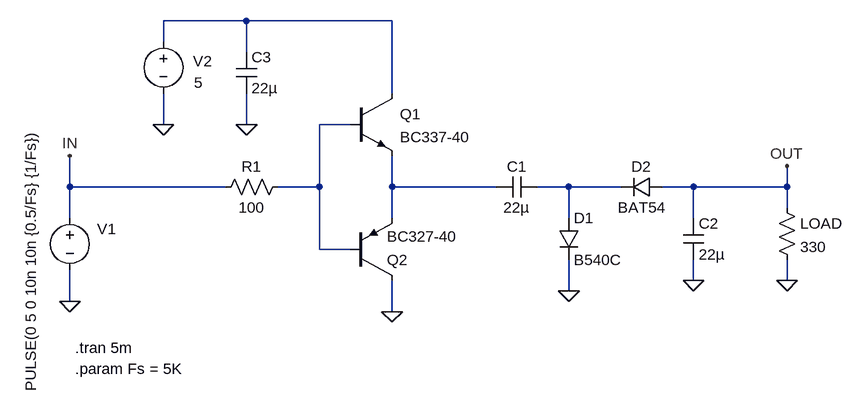
[diagram p0: schematic v1.0.asc]
v1.0.asc, the LTspice schematic file:
Version 4.1
SHEET 1 880 772
WIRE -288 -96 -416 -96
WIRE -64 -96 -288 -96
WIRE -416 -64 -416 -96
WIRE -288 -48 -288 -96
WIRE -64 16 -64 -96
WIRE -416 64 -416 16
WIRE -288 64 -288 16
WIRE -128 64 -176 64
WIRE -560 160 -560 112
WIRE -320 160 -560 160
WIRE -176 160 -176 64
WIRE -176 160 -240 160
WIRE -64 160 -64 112
WIRE 96 160 -64 160
WIRE 208 160 160 160
WIRE 288 160 208 160
WIRE 400 160 352 160
WIRE 544 160 544 128
WIRE 544 160 400 160
WIRE 544 192 544 160
WIRE -560 208 -560 160
WIRE -64 208 -64 160
WIRE 208 208 208 160
WIRE 400 208 400 160
WIRE -176 256 -176 160
WIRE -128 256 -176 256
WIRE 400 304 400 272
WIRE 544 304 544 272
WIRE 208 320 208 272
WIRE -560 336 -560 288
WIRE -64 352 -64 304
FLAG 400 304 0
FLAG 208 320 0
FLAG -560 336 0
FLAG -560 112 IN
FLAG 544 128 OUT
FLAG -64 352 0
FLAG -416 64 0
FLAG -288 64 0
FLAG 544 304 0
SYMBOL cap 160 144 R90
WINDOW 0 0 32 VBottom 2
WINDOW 3 32 32 VTop 2
SYMATTR InstName C1
SYMATTR Value 22µ
SYMBOL diode 192 208 R0
SYMATTR InstName D1
SYMATTR Value B540C
SYMBOL diode 352 144 R90
WINDOW 0 0 32 VBottom 2
WINDOW 3 32 32 VTop 2
SYMATTR InstName D2
SYMATTR Value BAT54
SYMBOL cap 384 208 R0
SYMATTR InstName C2
SYMATTR Value 22µ
SYMBOL voltage -560 192 R0
WINDOW 3 -60 -121 VRight 2
WINDOW 123 0 0 Left 0
WINDOW 39 0 0 Left 0
WINDOW 0 42 33 Left 2
SYMATTR Value PULSE(0 5 0 10n 10n {0.5/Fs} {1/Fs})
SYMATTR InstName V1
SYMBOL npn -128 16 R0
WINDOW 0 76 32 Left 2
WINDOW 3 76 67 Left 2
SYMATTR InstName Q1
SYMATTR Value BC337-40
SYMBOL pnp -128 304 M180
SYMATTR InstName Q2
SYMATTR Value BC327-40
SYMBOL voltage -416 -80 R0
WINDOW 0 46 46 Left 2
WINDOW 3 47 79 Left 2
WINDOW 123 0 0 Left 0
WINDOW 39 0 0 Left 0
SYMATTR InstName V2
SYMATTR Value 5
SYMBOL res -224 144 R90
WINDOW 0 0 56 VBottom 2
WINDOW 3 32 56 VTop 2
SYMATTR InstName R1
SYMATTR Value 100
SYMBOL cap -304 -48 R0
SYMATTR InstName C3
SYMATTR Value 22µ
SYMBOL res 528 176 R0
SYMATTR InstName LOAD
SYMATTR Value 330
TEXT -552 408 Left 2 !.tran 5m
TEXT -552 440 Left 2 !.param Fs = 5K

The netlist it stands for:
* v1.0.asc
C1 N004 N003 22µ
D1 N004 0 B540C
D2 OUT N004 BAT54
C2 OUT 0 22µ
V1 IN 0 PULSE(0 5 0 10n 10n {0.5/Fs} {1/Fs})
Q1 N001 N002 N003 0 BC337-40
Q2 0 N002 N003 0 BC327-40
V2 N001 0 5
R1 N002 IN 100
C3 N001 0 22µ
R§LOAD OUT 0 330
.model D D
.lib standard.dio
.model NPN NPN
.model PNP PNP
.lib standard.bjt
.tran 5m
.param Fs = 5K
.backanno
.end

* Results of the author's LTspice run, read from the files saved beside the schematic
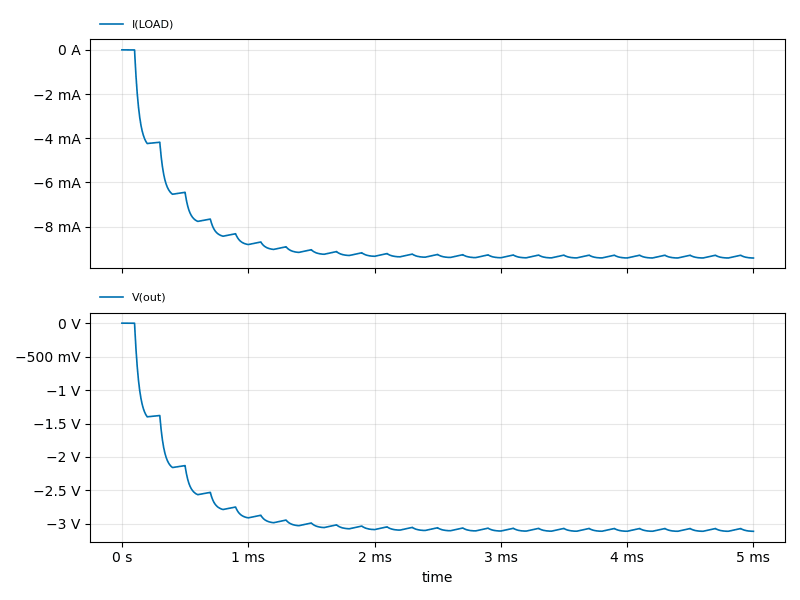
[diagram p1: Transient Analysis of v1.0.asc, plotted from the saved traces]
* Transient Analysis, 1 run:
*   I(LOAD): min -9.426 mA, max 1.747 nA, average -8.636 mA, rms 8.821 mA, last -9.426 mA
*   V(out): min -3.111 V, max 576.6 nV, average -2.85 V, rms 2.911 V, last -3.111 V